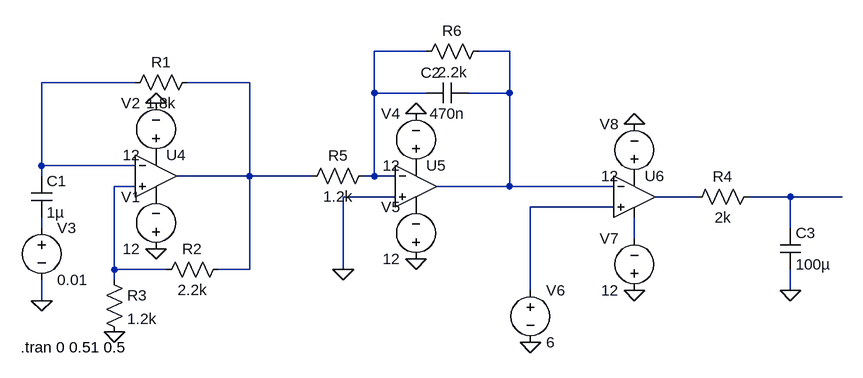
[diagram p0: schematic WARNING.asc]
WARNING.asc, the LTspice schematic file:
Version 4
SHEET 1 1300 680
WIRE 656 -32 576 -32
WIRE 784 -32 736 -32
WIRE 208 16 64 16
WIRE 384 16 288 16
WIRE 576 32 576 -32
WIRE 656 32 576 32
WIRE 784 32 784 -32
WIRE 784 32 720 32
WIRE 64 144 64 16
WIRE 208 144 64 144
WIRE 64 160 64 144
WIRE 384 160 384 16
WIRE 384 160 272 160
WIRE 480 160 384 160
WIRE 576 160 576 32
WIRE 576 160 560 160
WIRE 608 160 576 160
WIRE 208 176 176 176
WIRE 784 176 784 32
WIRE 784 176 672 176
WIRE 944 176 784 176
WIRE 608 192 528 192
WIRE 1072 192 1008 192
WIRE 1216 192 1152 192
WIRE 1296 192 1216 192
WIRE 944 208 816 208
WIRE 64 240 64 224
WIRE 1216 240 1216 192
WIRE 976 256 976 224
WIRE 176 304 176 176
WIRE 256 304 176 304
WIRE 384 304 384 160
WIRE 384 304 336 304
WIRE 528 304 528 192
WIRE 176 320 176 304
WIRE 816 336 816 208
WIRE 1216 336 1216 304
WIRE 64 352 64 320
FLAG 240 272 0
FLAG 240 48 0
FLAG 176 400 0
FLAG 64 352 0
FLAG 640 288 0
FLAG 640 64 0
FLAG 528 304 0
FLAG 816 416 0
FLAG 976 336 0
FLAG 976 80 0
FLAG 1216 336 0
SYMBOL res 304 0 R90
WINDOW 0 0 56 VBottom 2
WINDOW 3 32 56 VTop 2
SYMATTR InstName R1
SYMATTR Value 1.8k
SYMBOL res 352 288 R90
WINDOW 0 0 56 VBottom 2
WINDOW 3 32 56 VTop 2
SYMATTR InstName R2
SYMATTR Value 2.2k
SYMBOL res 160 304 R0
SYMATTR InstName R3
SYMATTR Value 1.2k
SYMBOL voltage 240 288 R180
WINDOW 0 24 96 Left 2
WINDOW 3 24 16 Left 2
WINDOW 123 0 0 Left 2
WINDOW 39 0 0 Left 2
SYMATTR InstName V1
SYMATTR Value 12
SYMBOL voltage 240 144 R180
WINDOW 0 24 96 Left 2
WINDOW 3 24 16 Left 2
WINDOW 123 0 0 Left 2
WINDOW 39 0 0 Left 2
SYMATTR InstName V2
SYMATTR Value 12
SYMBOL voltage 64 224 R0
WINDOW 123 0 0 Left 2
WINDOW 39 0 0 Left 2
SYMATTR InstName V3
SYMATTR Value 0.01
SYMBOL res 576 144 R90
WINDOW 0 0 56 VBottom 2
WINDOW 3 32 56 VTop 2
SYMATTR InstName R5
SYMATTR Value 1.2k
SYMBOL res 752 -48 R90
WINDOW 0 0 56 VBottom 2
WINDOW 3 32 56 VTop 2
SYMATTR InstName R6
SYMATTR Value 2.2k
SYMBOL cap 720 16 R90
WINDOW 0 0 57 VBottom 2
WINDOW 3 32 32 VTop 2
SYMATTR InstName C2
SYMATTR Value 470n
SYMBOL voltage 640 160 R180
WINDOW 0 24 96 Left 2
WINDOW 3 24 16 Left 2
WINDOW 123 0 0 Left 2
WINDOW 39 0 0 Left 2
SYMATTR InstName V4
SYMATTR Value 12
SYMBOL voltage 640 304 R180
WINDOW 0 24 96 Left 2
WINDOW 3 24 16 Left 2
WINDOW 123 0 0 Left 2
WINDOW 39 0 0 Left 2
SYMATTR InstName V5
SYMATTR Value 12
SYMBOL voltage 816 320 R0
WINDOW 123 0 0 Left 2
WINDOW 39 0 0 Left 2
SYMATTR InstName V6
SYMATTR Value 6
SYMBOL voltage 976 352 R180
WINDOW 0 24 96 Left 2
WINDOW 3 24 16 Left 2
WINDOW 123 0 0 Left 2
WINDOW 39 0 0 Left 2
SYMATTR InstName V7
SYMATTR Value 12
SYMBOL voltage 976 176 R180
WINDOW 0 24 96 Left 2
WINDOW 3 24 16 Left 2
WINDOW 123 0 0 Left 2
WINDOW 39 0 0 Left 2
SYMATTR InstName V8
SYMATTR Value 12
SYMBOL cap 48 160 R0
SYMATTR InstName C1
SYMATTR Value 1µ
SYMBOL Opamps\\UniversalOpamp2 240 160 R0
SYMATTR InstName U4
SYMBOL Opamps\\UniversalOpamp2 640 176 R0
SYMATTR InstName U5
SYMBOL Opamps\\UniversalOpamp2 976 192 R0
SYMATTR InstName U6
SYMBOL res 1056 208 R270
WINDOW 0 32 56 VTop 2
WINDOW 3 0 56 VBottom 2
SYMATTR InstName R4
SYMATTR Value 2k
SYMBOL cap 1200 240 R0
SYMATTR InstName C3
SYMATTR Value 100µ
TEXT 32 424 Left 2 !.tran 0 0.51 0.5

The netlist it stands for:
* WARNING.asc
R1 N004 N003 1.8k
R2 N004 N005 2.2k
R3 N005 0 1.2k
V1 0 P001 12
V2 P002 0 12
V3 N009 0 0.01
R5 N001 N004 1.2k
R6 N002 N001 2.2k
C2 N002 N001 470n
V4 P003 0 12
V5 0 P004 12
V6 N008 0 6
V7 0 N010 12
V8 P005 0 12
C1 N003 N009 1µ
XU4 N005 N003 P002 P001 N004 level.2 Avol=1Meg GBW=10Meg Slew=10Meg ilimit=25m rail=0 Vos=0 phimargin=45 en=0 enk=0 in=0 ink=0 Rin=500Meg  ; pins IN+ IN- V+ V- OUT
XU5 0 N001 P003 P004 N002 level.2 Avol=1Meg GBW=10Meg Slew=10Meg ilimit=25m rail=0 Vos=0 phimargin=45 en=0 enk=0 in=0 ink=0 Rin=500Meg  ; pins IN+ IN- V+ V- OUT
XU6 N008 N002 P005 N010 N006 level.2 Avol=1Meg GBW=10Meg Slew=10Meg ilimit=25m rail=0 Vos=0 phimargin=45 en=0 enk=0 in=0 ink=0 Rin=500Meg  ; pins IN+ IN- V+ V- OUT
R4 N006 N007 2k
C3 N007 0 100µ
.tran 0 0.51 0.5
.lib UniversalOpamps2.sub
.backanno
.end